# Altium schematic sheet Matrix_Controller.SchDoc
size A4; DocumentName: Matrix controller
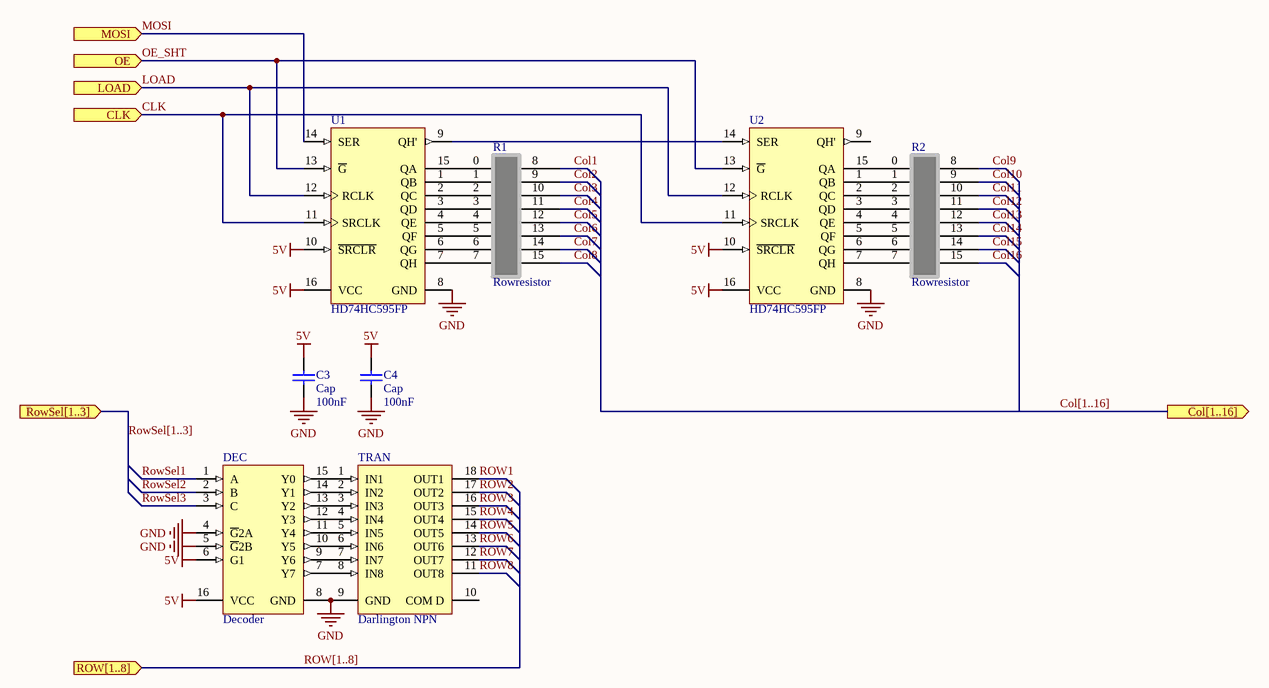
[diagram p0: Matrix_Controller.SchDoc]

## Parts
C3  Cap  value 100nF  [6-0805_M]
C4  Cap  value 100nF  [6-0805_M]
DEC  Decoder  [PRSP0016DH-B_N]
R1  Rowresistor  [Rowres]
R2  Rowresistor  [Rowres]
TRAN  Darlington NPN  [LW18_N]
U1  HD74HC595FP  [PRSP0016DH-B_N]
U2  HD74HC595FP  [PRSP0016DH-B_N]

## Ports
CLK (in), Col[1..16] (out), LOAD (in), MOSI (in), OE (in), ROW[1..8] (in), RowSel[1..3] (in)

## Nets
5V: C3.1 C4.1 DEC.6(G1) DEC.16(VCC) U1.10(~{SRCLR}) U1.16(VCC) U2.10(~{SRCLR}) U2.16(VCC)
GND: C3.2 C4.2 DEC.4(~{G}2A) DEC.5(~{G}2B) DEC.8(GND) TRAN.9(GND) U1.8(GND) U2.8(GND)
CLK: U1.11(SRCLK) U2.11(SRCLK) ; port CLK
Col1: R1.8
Col2: R1.9
Col3: R1.10
Col4: R1.11
Col5: R1.12
Col6: R1.13
Col7: R1.14
Col8: R1.15
Col9: R2.8
Col10: R2.9
Col11: R2.10
Col12: R2.11
Col13: R2.12
Col14: R2.13
Col15: R2.14
Col16: R2.15
LOAD: U1.12(RCLK) U2.12(RCLK) ; port LOAD
MOSI: U1.14(SER) ; port MOSI
OE_SHT: U1.13(~{G}) U2.13(~{G}) ; port OE
ROW1: TRAN.18(OUT1)
ROW2: TRAN.17(OUT2)
ROW3: TRAN.16(OUT3)
ROW4: TRAN.15(OUT4)
ROW5: TRAN.14(OUT5)
ROW6: TRAN.13(OUT6)
ROW7: TRAN.12(OUT7)
ROW8: TRAN.11(OUT8)
RowSel1: DEC.1(A)
RowSel2: DEC.2(B)
RowSel3: DEC.3(C)
NetDEC_7: DEC.7(Y7) TRAN.8(IN8)
NetDEC_9: DEC.9(Y6) TRAN.7(IN7)
NetDEC_10: DEC.10(Y5) TRAN.6(IN6)
NetDEC_11: DEC.11(Y4) TRAN.5(IN5)
NetDEC_12: DEC.12(Y3) TRAN.4(IN4)
NetDEC_13: DEC.13(Y2) TRAN.3(IN3)
NetDEC_14: DEC.14(Y1) TRAN.2(IN2)
NetDEC_15: DEC.15(Y0) TRAN.1(IN1)
NetR1_0: R1.0 U1.15(QA)
NetR1_1: R1.1 U1.1(QB)
NetR1_2: R1.2 U1.2(QC)
NetR1_3: R1.3 U1.3(QD)
NetR1_4: R1.4 U1.4(QE)
NetR1_5: R1.5 U1.5(QF)
NetR1_6: R1.6 U1.6(QG)
NetR1_7: R1.7 U1.7(QH)
NetR2_0: R2.0 U2.15(QA)
NetR2_1: R2.1 U2.1(QB)
NetR2_2: R2.2 U2.2(QC)
NetR2_3: R2.3 U2.3(QD)
NetR2_4: R2.4 U2.4(QE)
NetR2_5: R2.5 U2.5(QF)
NetR2_6: R2.6 U2.6(QG)
NetR2_7: R2.7 U2.7(QH)
NetU1_9: U1.9(QH') U2.14(SER)

Not connected (* = marked no-connect by the designer): TRAN 10(COM_D); U2 9(QH')

## Buses and harness runs
bus Col[1..16] = port Col[1..16]
bus ROW[1..8] = port ROW[1..8]
bus RowSel[1..3] = port RowSel[1..3]

## Library data of the parts
C3 C4 = Cap: Capacitor; Published: 8-Jun-2000; LatestRevisionDate: 17-Jul-2002; LatestRevisionNote: Re-released for DXP Platform.; PackageReference: RAD-0.3; Publisher: Altium Limited; PackageDescription: Radial Cap, Thru-Hole; 2 Leads; 0.3 in Pin Spacing
DEC = HD74HC238FP: 3-to-8 Line Decoder / Demultiplexer; Published: 10-Feb-2010; DatasheetVersion: Rev.2.00, Jan-2006; PackageVersion: Sep-2005; PackageReference: PRSP0016DH-B; Publisher: Altium Limited; PackageDescription: 16-Pin Plastic Small Outline Package 1.27 mm Pitch; Code_JEITA: P-SOP16-5.5x10.06-1.27; ComponentLink1Description: Manufacturer Link; ComponentLink1URL: http://sg.renesas.com/fmwk.jsp?cnt=hd74hc_root.jsp&fp=/products/standard_ic/general_purpose_logic/5v_standard_logic/hd74hc/; ComponentLink2Description: Datasheet; ComponentLink2URL: http://documentation.renesas.com/eng/products/logic/rej03d0593_hd74hc238ds.pdf; ComponentLink3Description: Packaging Specification; ComponentLink3URL: http://sg.renesas.com/media/products/common_info/package/pdf/ic/code/prsp0016dh_b.pdf
R1 R2 = Rowres: Row resistor, 8
TRAN = ULN2803LW: High-Voltage, High-Current Darlington Array; Published: 13-Oct-2000; LatestRevisionDate: 13-Apr-2006; LatestRevisionNote: IPC-7351 Footprint Added.; DatasheetVersion: 1999; PackageReference: LW18; Publisher: Altium Limited; PackageDescription: 18-Pin Small Outline Integrated Circuit 1.27 mm Pitch; Code_JEDEC: MS-013-AB; ComponentLink1Description: Manufacturer Link; ComponentLink1URL: http://www.allegromicro.com/
U1 U2 = HD74HC595FP: 8-bit Shift Register / Latch with 3-State Outputs; Published: 10-Feb-2010; DatasheetVersion: Rev.2.00, Mar-2006; PackageVersion: Sep-2005; PackageReference: PRSP0016DH-B; Publisher: Altium Limited; PackageDescription: 16-Pin Plastic Small Outline Package 1.27 mm Pitch; Code_JEITA: P-SOP16-5.5x10.06-1.27; ComponentLink1Description: Manufacturer Link; ComponentLink1URL: http://sg.renesas.com/fmwk.jsp?cnt=hd74hc_root.jsp&fp=/products/standard_ic/general_purpose_logic/5v_standard_logic/hd74hc/; ComponentLink2Description: Datasheet; ComponentLink2URL: http://documentation.renesas.com/eng/products/logic/rej03d0634_hd74hc595ds.pdf; ComponentLink3Description: Packaging Specification; ComponentLink3URL: http://sg.renesas.com/media/products/common_info/package/pdf/ic/code/prsp0016dh_b.pdf